# Altium project RGB_Board.PrjPcb
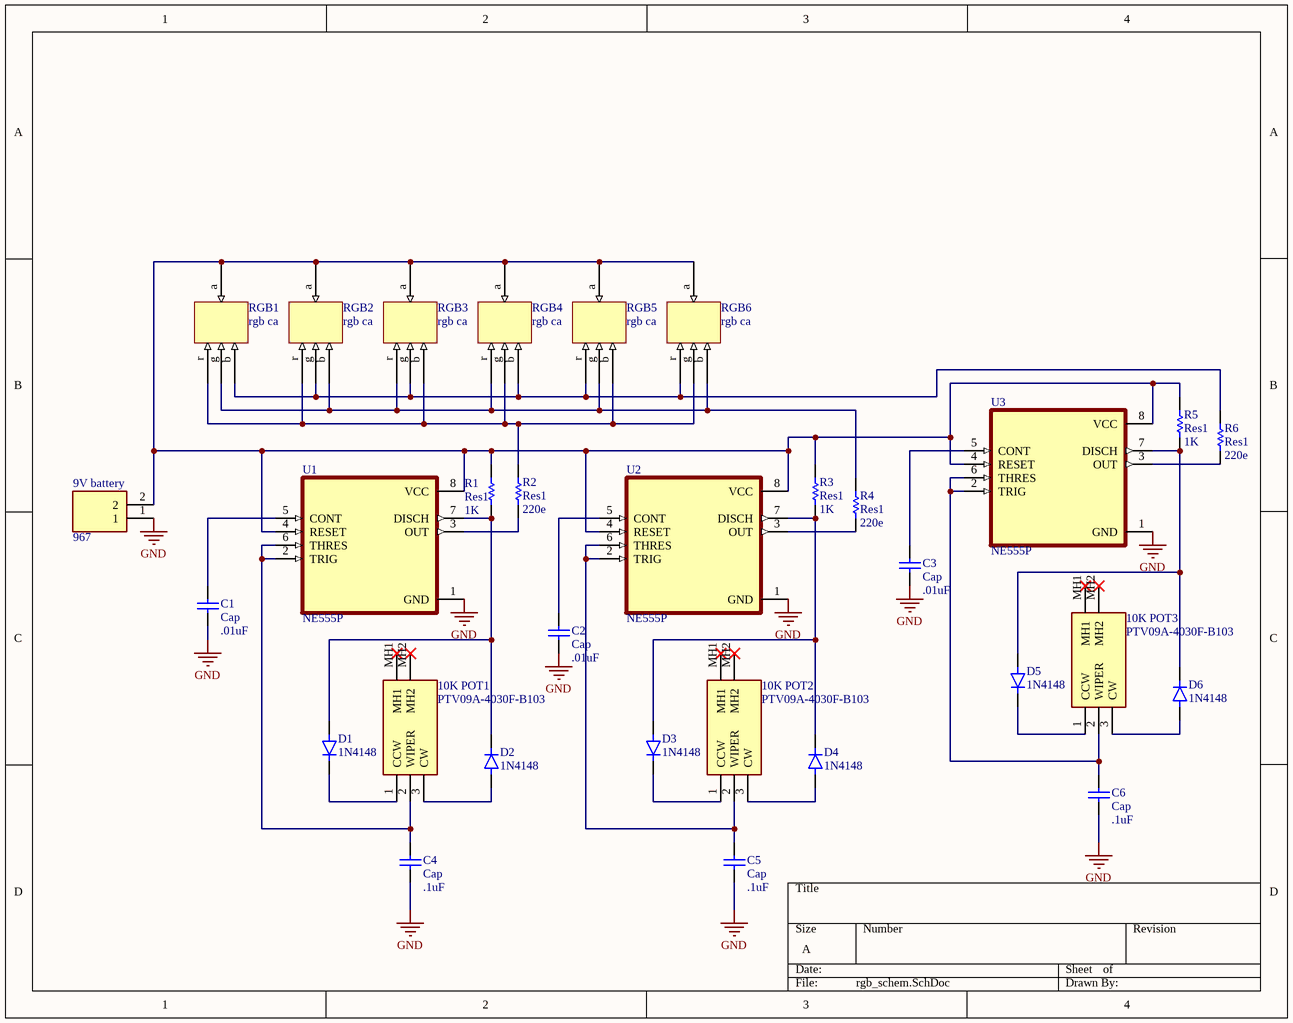
[diagram p0: rgb_schem.SchDoc]
1 sheet, 31 parts. Net scope: global (net labels, ports and power ports of the same name join across sheets).
Board file: rgb_pcb.PcbDoc

## Sheet rgb_schem.SchDoc
size A; SheetNumber: 1; SheetTotal: 1

### Parts
9V_battery  967  [967]
10K_POT1  PTV09A-4030F-B103  [PTV09A4030FB103]
10K_POT2  PTV09A-4030F-B103  [PTV09A4030FB103]
10K_POT3  PTV09A-4030F-B103  [PTV09A4030FB103]
C1  Cap  value .01uF  [RAD-0.3]
C2  Cap  value .01uF  [RAD-0.3]
C3  Cap  value .01uF  [RAD-0.3]
C4  Cap  value .1uF  [RAD-0.3]
C5  Cap  value .1uF  [RAD-0.3]
C6  Cap  value .1uF  [RAD-0.3]
D1  1N4148  [DIOAD829W49L456D191]
D2  1N4148  [DIOAD829W49L456D191]
D3  1N4148  [DIOAD829W49L456D191]
D4  1N4148  [DIOAD829W49L456D191]
D5  1N4148  [DIOAD829W49L456D191]
D6  1N4148  [DIOAD829W49L456D191]
R1  Res1  value 1K  [AXIAL-0.3]
R2  Res1  value 220e  [AXIAL-0.3]
R3  Res1  value 1K  [AXIAL-0.3]
R4  Res1  value 220e  [AXIAL-0.3]
R5  Res1  value 1K  [AXIAL-0.3]
R6  Res1  value 220e  [AXIAL-0.3]
RGB1  rgb ca  [RGB CA]
RGB2  rgb ca  [RGB CA]
RGB3  rgb ca  [RGB CA]
RGB4  rgb ca  [RGB CA]
RGB5  rgb ca  [RGB CA]
RGB6  rgb ca  [RGB CA]
U1  NE555P  [DIP794W45P254L959H508Q8]
U2  NE555P  [DIP794W45P254L959H508Q8]
U3  NE555P  [DIP794W45P254L959H508Q8]

### Nets
GND: 9V_battery.1 C1.1 C2.1 C3.1 C4.1 C5.1 C6.1 U1.1(GND) U2.1(GND) U3.1(GND)
Net9V_battery_2: 9V_battery.2 R1.2 R3.2 R5.2 RGB1.a RGB2.a RGB3.a RGB4.a RGB5.a RGB6.a U1.4(RESET) U1.8(VCC) U2.4(RESET) U2.8(VCC) U3.4(RESET) U3.8(VCC)
Net10K_POT1_1: 10K_POT1.1(CCW) D1.C
Net10K_POT1_2: 10K_POT1.2(WIPER) C4.2 U1.2(TRIG) U1.6(THRES)
Net10K_POT1_3: 10K_POT1.3(CW) D2.A
Net10K_POT2_1: 10K_POT2.1(CCW) D3.C
Net10K_POT2_2: 10K_POT2.2(WIPER) C5.2 U2.2(TRIG) U2.6(THRES)
Net10K_POT2_3: 10K_POT2.3(CW) D4.A
Net10K_POT3_1: 10K_POT3.1(CCW) D5.C
Net10K_POT3_2: 10K_POT3.2(WIPER) C6.2 U3.2(TRIG) U3.6(THRES)
Net10K_POT3_3: 10K_POT3.3(CW) D6.A
NetC1_2: C1.2 U1.5(CONT)
NetC2_2: C2.2 U2.5(CONT)
NetC3_2: C3.2 U3.5(CONT)
NetD1_A: D1.A D2.C R1.1 U1.7(DISCH)
NetD3_A: D3.A D4.C R3.1 U2.7(DISCH)
NetD5_A: D5.A D6.C R5.1 U3.7(DISCH)
NetR2_1: R2.1 U1.3(OUT)
NetR2_2: R2.2 RGB1.r RGB2.r RGB3.b RGB4.g RGB5.b RGB6.g
NetR4_1: R4.1 U2.3(OUT)
NetR4_2: R4.2 RGB1.g RGB2.b RGB3.r RGB4.r RGB5.g RGB6.b
NetR6_1: R6.1 U3.3(OUT)
NetR6_2: R6.2 RGB1.b RGB2.g RGB3.g RGB4.b RGB5.r RGB6.r

Not connected (* = marked no-connect by the designer): 10K_POT1 MH1* MH2*; 10K_POT2 MH1* MH2*; 10K_POT3 MH1* MH2*

### Library data of the parts
9V_battery = 967: Undefined or Miscellaneous; Manufacturer_Name: Keystone Electronics; Datasheet Link: https://componentsearchengine.com//967.pdf; Mouser2 Part Number: 534-967; Mouser2 Price/Stock: https://www.mouser.com/Search/Refine.aspx?Keyword=534-967; Manufacturer_Part_Number: 967
10K_POT1-10K_POT3 = PTV09A-4030F-B103: Variable Resistor; Manufacturer_Name: Bourns; Datasheet Link: https://componentsearchengine.com//PTV09A-4030F-B103.pdf; Height: 30.5mm; Mouser2 Part Number: 652-PTV09A4030FB103; Mouser2 Price/Stock: https://www.mouser.com/Search/Refine.aspx?Keyword=652-PTV09A4030FB103; Manufacturer_Part_Number: PTV09A-4030F-B103
C1-C6 = Cap: Capacitor; Published: 8-Jun-2000; LatestRevisionDate: 17-Jul-2002; LatestRevisionNote: Re-released for DXP Platform.; PackageReference: RAD-0.3; Publisher: Altium Limited; PackageDescription: Radial Cap, Thru-Hole; 2 Leads; 0.3 in Pin Spacing
D1-D6 = 1N4148: DIODE FAST SIGNAL 500MA/100V; MF: MICROSS/On Semiconductor; SnapEDA_Link: https://www.snapeda.com/parts/1N4148/MICROSS/On%20Semiconductor/view-part/9246/?ref=snap; MP: 1N4148; Availability: Unavailable; Price: None; Value: *; Package: DO-35 Fairchild Semiconductor
R1-R6 = Res1: Resistor; Published: 8-Jun-2000; LatestRevisionDate: 17-Jul-2002; LatestRevisionNote: Re-released for DXP Platform.; PackageReference: AXIAL-0.3; Publisher: Altium Limited; PackageDescription: Axial Device, Thru-Hole; 2 Leads; 0.3 in Pin Spacing
RGB1-RGB6 = rgb ca: pin to pad: anode>a
U1-U3 = NE555P: Single Precision Timer; MF: Texas Instruments; Package: PDIP-8 Texas Instruments; Value: *; MP: NE555P; Texas_Instruments-Purchase-URL: https://snapeda.com/shop?store=Texas+Instruments&id=2776400; Arrow_Electronics-Purchase-URL: https://snapeda.com/shop?store=Arrow+Electronics&id=2776400; Mouser-Purchase-URL: https://snapeda.com/shop?store=Mouser&id=2776400; DigiKey-Purchase-URL: https://snapeda.com/shop?store=DigiKey&id=2776400; SnapEDA_Link: https://www.snapeda.com/parts/NE555P/Texas%20Instruments/view-part/2776400/?ref=snap